# Altium schematic sheet Power ATX.SchDoc
size A4
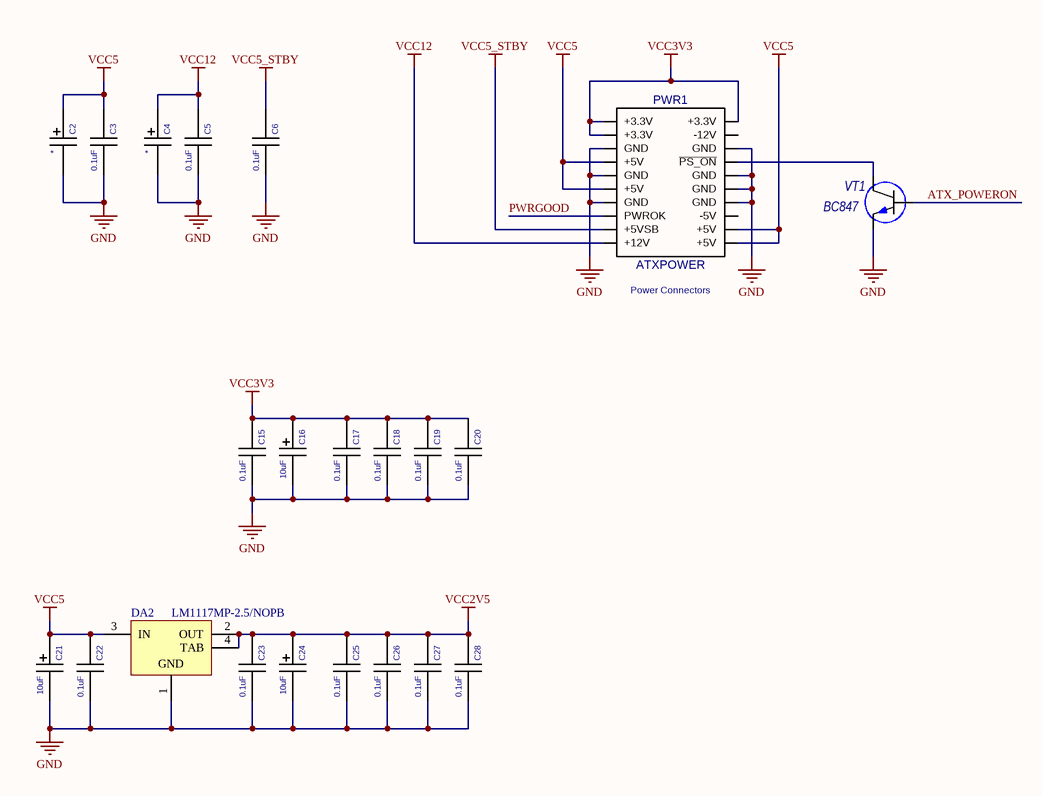
[diagram p0: Power ATX.SchDoc]

## Parts
C2  ECAPCHIPB  [EC-CHIPB]  (value not drawn)
C3  value 0.1uF  [C-CHIP]  (hidden comment: CAPCHIP)
C4  ECAPCHIPB  [EC-CHIPB]  (value not drawn)
C5  value 0.1uF  [C-CHIP]  (hidden comment: CAPCHIP)
C6  value 0.1uF  [C-CHIP]  (hidden comment: CAPCHIP)
C15  value 0.1uF  [C-CHIP]  (hidden comment: CAPCHIP)
C16  value 10uF  [EC-CHIP]  (hidden comment: ECAPCHIP)
C17  value 0.1uF  [C-CHIP]  (hidden comment: CAPCHIP)
C18  value 0.1uF  [C-CHIP]  (hidden comment: CAPCHIP)
C19  value 0.1uF  [C-CHIP]  (hidden comment: CAPCHIP)
C20  value 0.1uF  [C-CHIP]  (hidden comment: CAPCHIP)
C21  value 10uF  [EC-CHIP]  (hidden comment: ECAPCHIP)
C22  value 0.1uF  [C-CHIP]  (hidden comment: CAPCHIP)
C23  value 0.1uF  [C-CHIP]  (hidden comment: CAPCHIP)
C24  value 10uF  [EC-CHIP]  (hidden comment: ECAPCHIP)
C25  value 0.1uF  [C-CHIP]  (hidden comment: CAPCHIP)
C26  value 0.1uF  [C-CHIP]  (hidden comment: CAPCHIP)
C27  value 0.1uF  [C-CHIP]  (hidden comment: CAPCHIP)
C28  value 0.1uF  [C-CHIP]  (hidden comment: CAPCHIP)
DA2  LM1117MP-2.5/NOPB  [DCY0004A_M]
PWR1  ATXPOWER  [ATXPOWER]
VT1  BC847  [SOT-23]

## Nets
GND: C2.2 C3.2 C4.2 C5.2 C6.2 C15.2 C16.2 C17.2 C18.2 C19.2 C20.2 C21.2 C22.2 C23.2 C24.2 C25.2 C26.2 C27.2 C28.2 DA2.1(GND) PWR1.3(GND) PWR1.5(GND) PWR1.7(GND) PWR1.13(GND) PWR1.15(GND) PWR1.16(GND) PWR1.17(GND) VT1.2(emitter)
VCC2V5: C23.1 C24.1 C25.1 C26.1 C27.1 C28.1 DA2.2(OUT) DA2.4(TAB)
VCC3V3: C15.1 C16.1 C17.1 C18.1 C19.1 C20.1 PWR1.1(+3.3V) PWR1.2(+3.3V) PWR1.11(+3.3V)
VCC5: C2.1 C3.1 C21.1 C22.1 DA2.3(IN) PWR1.4(+5V) PWR1.6(+5V) PWR1.19(+5V) PWR1.20(+5V)
VCC5_STBY: C6.1 PWR1.9(+5VSB)
VCC12: C4.1 C5.1 PWR1.10(+12V)
ATX_POWERON: VT1.1(base)
PWRGOOD: PWR1.8(PWROK)
NetPWR1_14: PWR1.14(~{PS_ON}) VT1.3(collector)

Not connected (* = marked no-connect by the designer): PWR1 12(-12V) 18(-5V)

## Notes on the sheet
- (near PWR1) Power Connectors

## Library data of the parts
DA2 = CMP-0062-01660-4: 800mA Low-Dropout Linear Regulator, 4-pin SOT-223, Pb-Free; Manufacturer: Texas Instruments; PackageTopMarking: XYTT*N13A; CompType: LDO IC; PowerWise: N; High-Reliability: Y; Code_JEDEC: TO-261-AA; Code_IPC: SOT223-4; PartNumber: LM1117MP-2.5/NOPB; PackageDescription: Molded SOT-223, 6.50 x 3.56 x 1.6mm Body, 4 Lead, 2.3mm Pitch; PackageReference: DCY0004A; PinCount: 4; ComponentLink1URL: http://www.ti.com/general/docs/lit/getliterature.tsp?genericPartNumber=LM1117-N&fileType=pdf; RoHS: Y; ComponentLink1Description: Datasheet URL
C2 C4 = ECAPCHIPB: Value: *
PWR1 = ATXPOWER: Value: *